# EasyEDA schematic SCH_New-Project_2025-02-11.json
TITLE: PCB Assignment; REV: 1.0; Date: 2025-02-08; Sheet: 1/1; Drawn By: Rajdeep Gill; Company: University of Manitoba
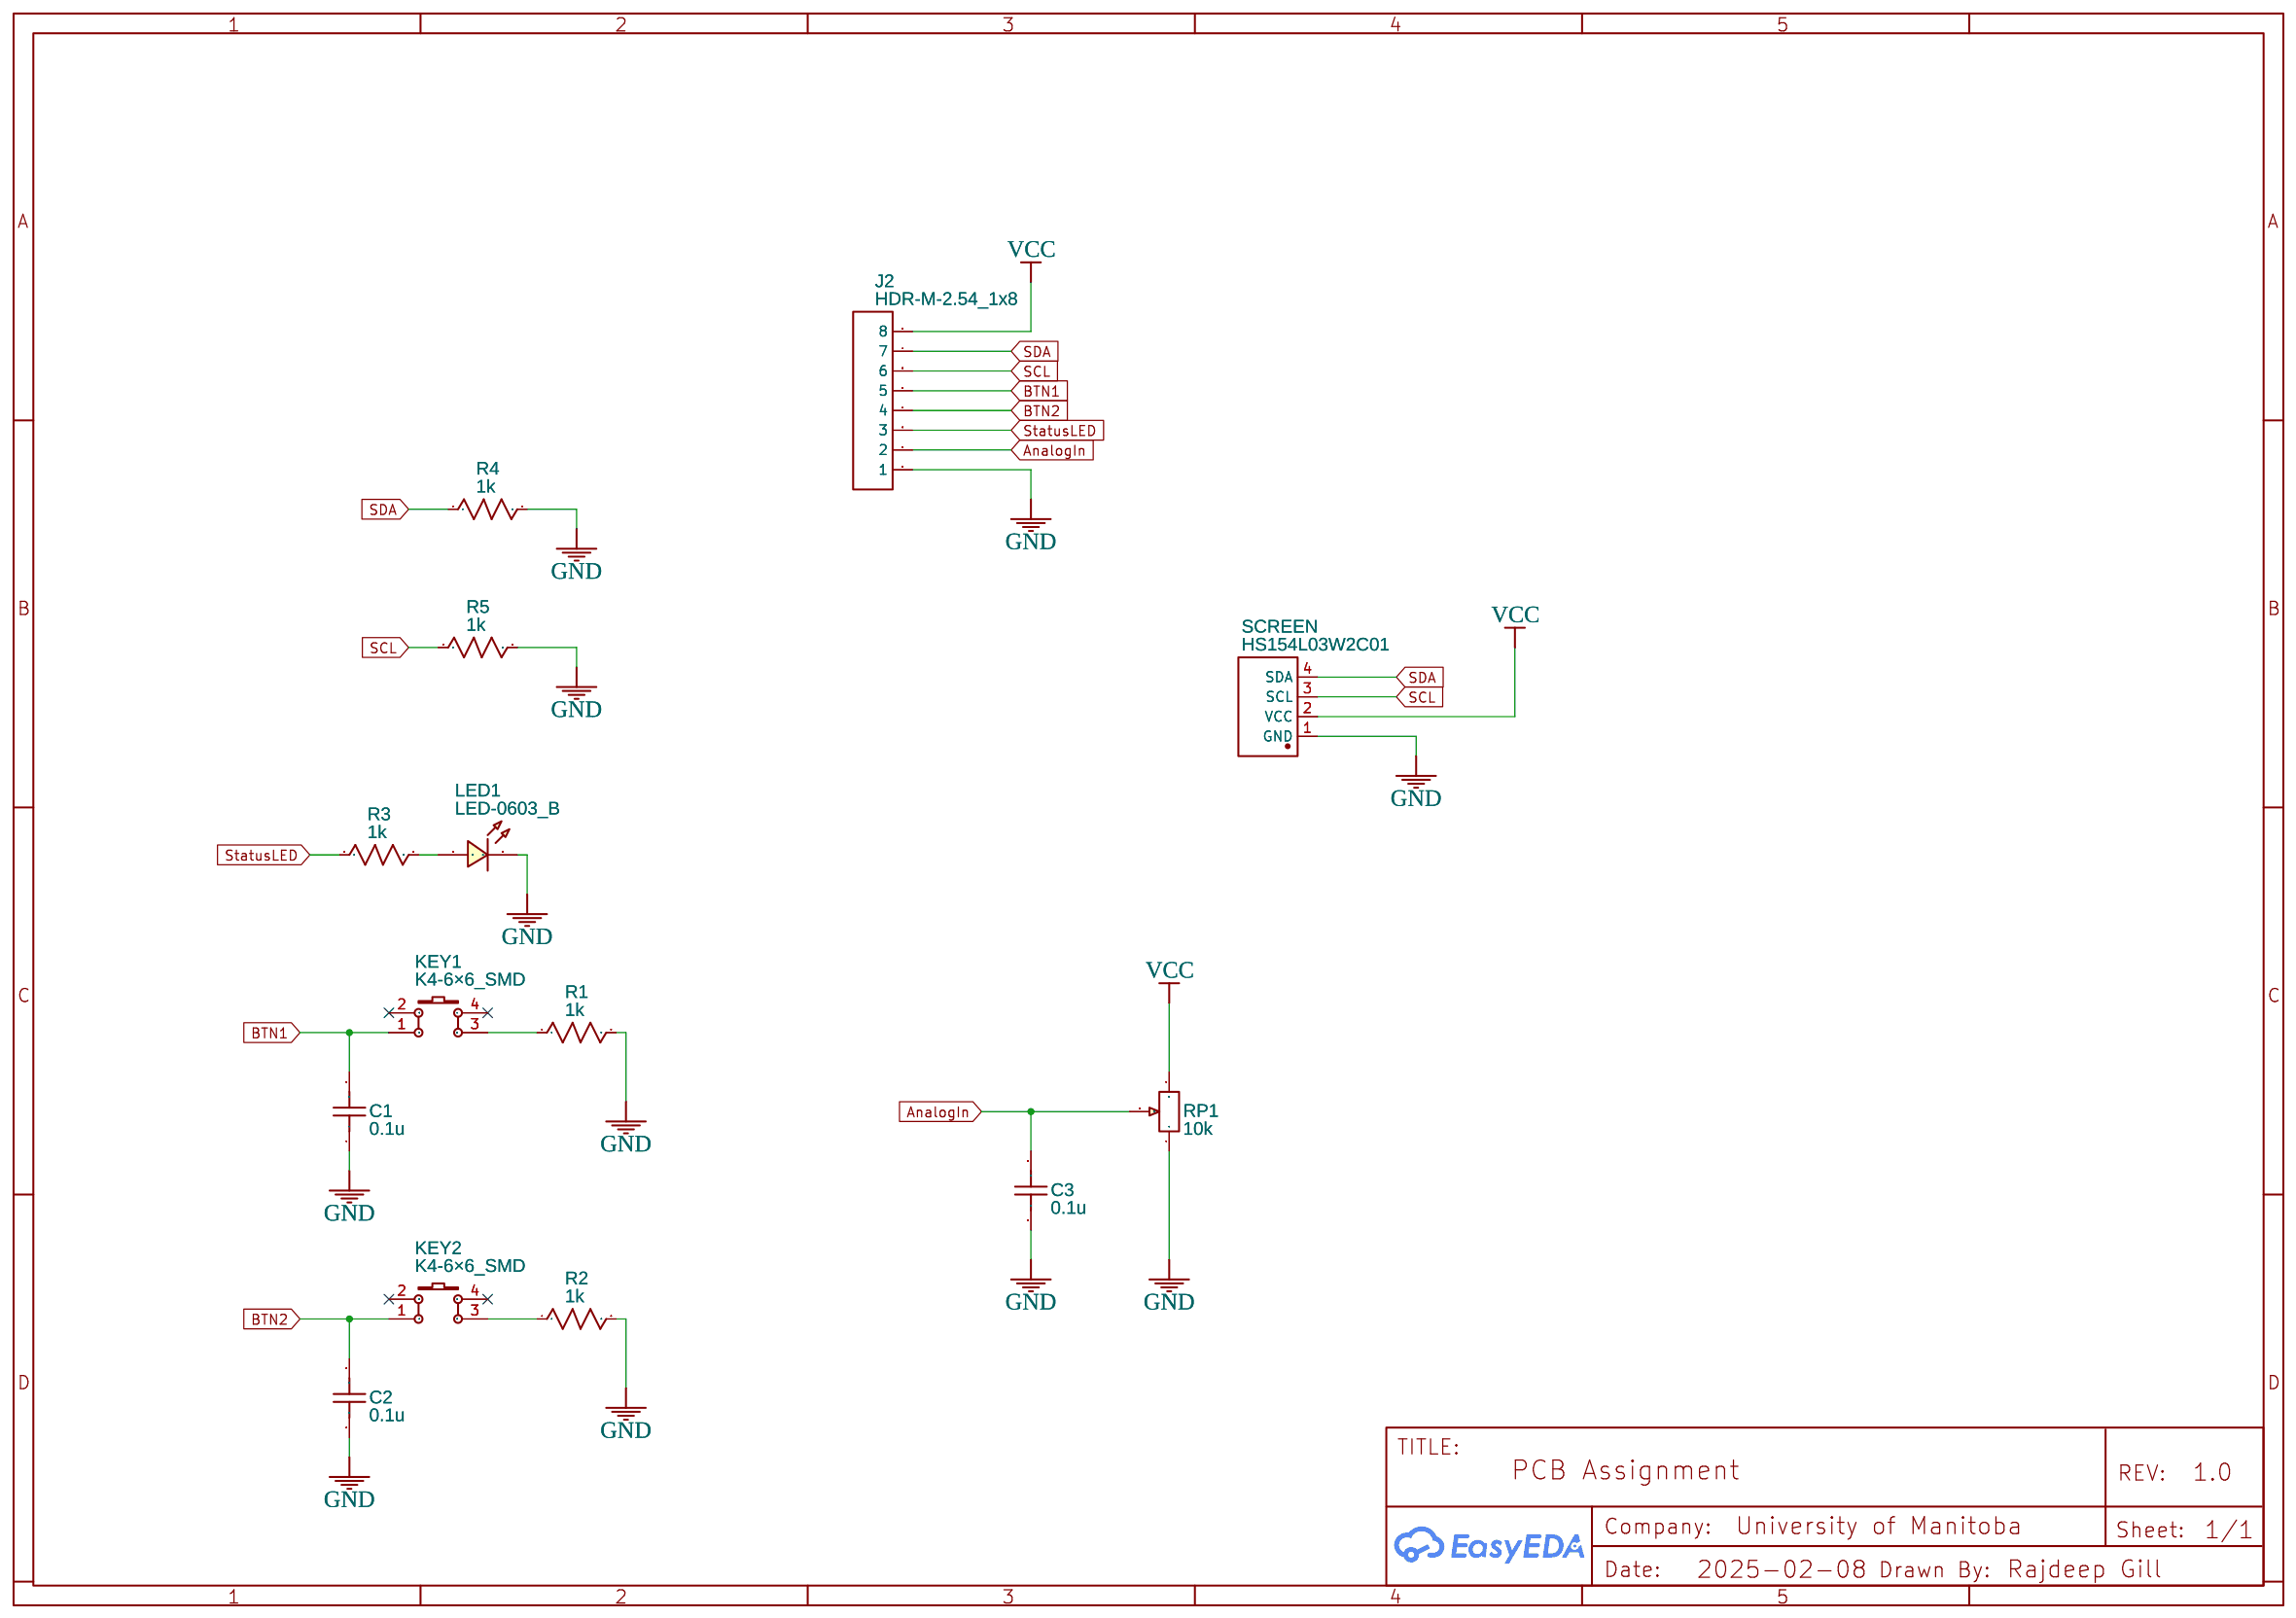
[diagram p0: schematic sheet]

## Parts
C1  0.1u  [C0603]
C2  0.1u  [C0603]
C3  0.1u  [C0603]
J2  HDR-M-2.54_1x8  [HDR-M-2.54_1X8]
KEY1  K4-6×6_SMD  [KEY-SMD_4P-L6.0-W6.0-P3.90-LS10.0]
KEY2  K4-6×6_SMD  [KEY-SMD_4P-L6.0-W6.0-P3.90-LS10.0]
LED1  LED-0603_B  [LED0603_BLUE]
R1  1k  [R0603]
R2  1k  [R0603]
R3  1k  [R0603]
R4  1k  [R0603]
R5  1k  [R0603]
RP1  10k  [RES-ADJ-TH_3386P]
SCREEN  HS154L03W2C01  [OLED-TH_-4P-L42.4-W38.0-P2.54]

## Library data of the parts
C1-C3 = C_0603_US: Contributor: LCEDA_Lib
J2 = HDR-M-2.54_1x8: Supplier Part: C190820; Supplier: LCSC; Contributor: LCEDA_Lib
KEY1 KEY2 = K4-6×6_SMD: Supplier Part: C191626; Supplier: LCSC; Manufacturer: 韩国韩荣; Manufacturer Part: K2-6639SP-D4SC-04; Contributor: LCEDA_Lib
LED1 = LED-0603_B: Manufacturer: EVERLIGHT(台湾亿光); Manufacturer Part: 19-217/BHC-ZL1M2RY/3T; Supplier Part: C72041; Supplier: LCSC; Contributor: LCEDA_01
R1-R5 = R_0603_US: Contributor: LCEDA_Lib
RP1 = R_3386P_EU: Supplier: LCSC; Contributor: LCEDA_Lib; Value(Ω): 10K
SCREEN = HS154L03W2C01: Supplier: LCSC; Supplier Part: C7465999; Manufacturer: HS(汉昇); Contributor: lcsc; JLCPCB Part Class: Extended Part

## Nets
GND: C1.1 C2.1 C3.1 J2.1 LED1.2 R1.2 R2.2 R4.2 R5.2 RP1.1 SCREEN.1(GND)
VCC: J2.8 RP1.3 SCREEN.2(VCC)
AnalogIn: C3.2 J2.2 RP1.2
BTN1: C1.2 J2.5 KEY1.1
BTN2: C2.2 J2.4 KEY2.1
SCL: J2.6 R5.1 SCREEN.3(SCL)
SDA: J2.7 R4.1 SCREEN.4(SDA)
StatusLED: J2.3 R3.1
Net-(KEY1-3): KEY1.3 R1.1
Net-(KEY2-3): KEY2.3 R2.1
Net-(LED1-1): LED1.1 R3.2

Not connected (* = marked no-connect by the designer): KEY1 2* 4*; KEY2 2* 4*
